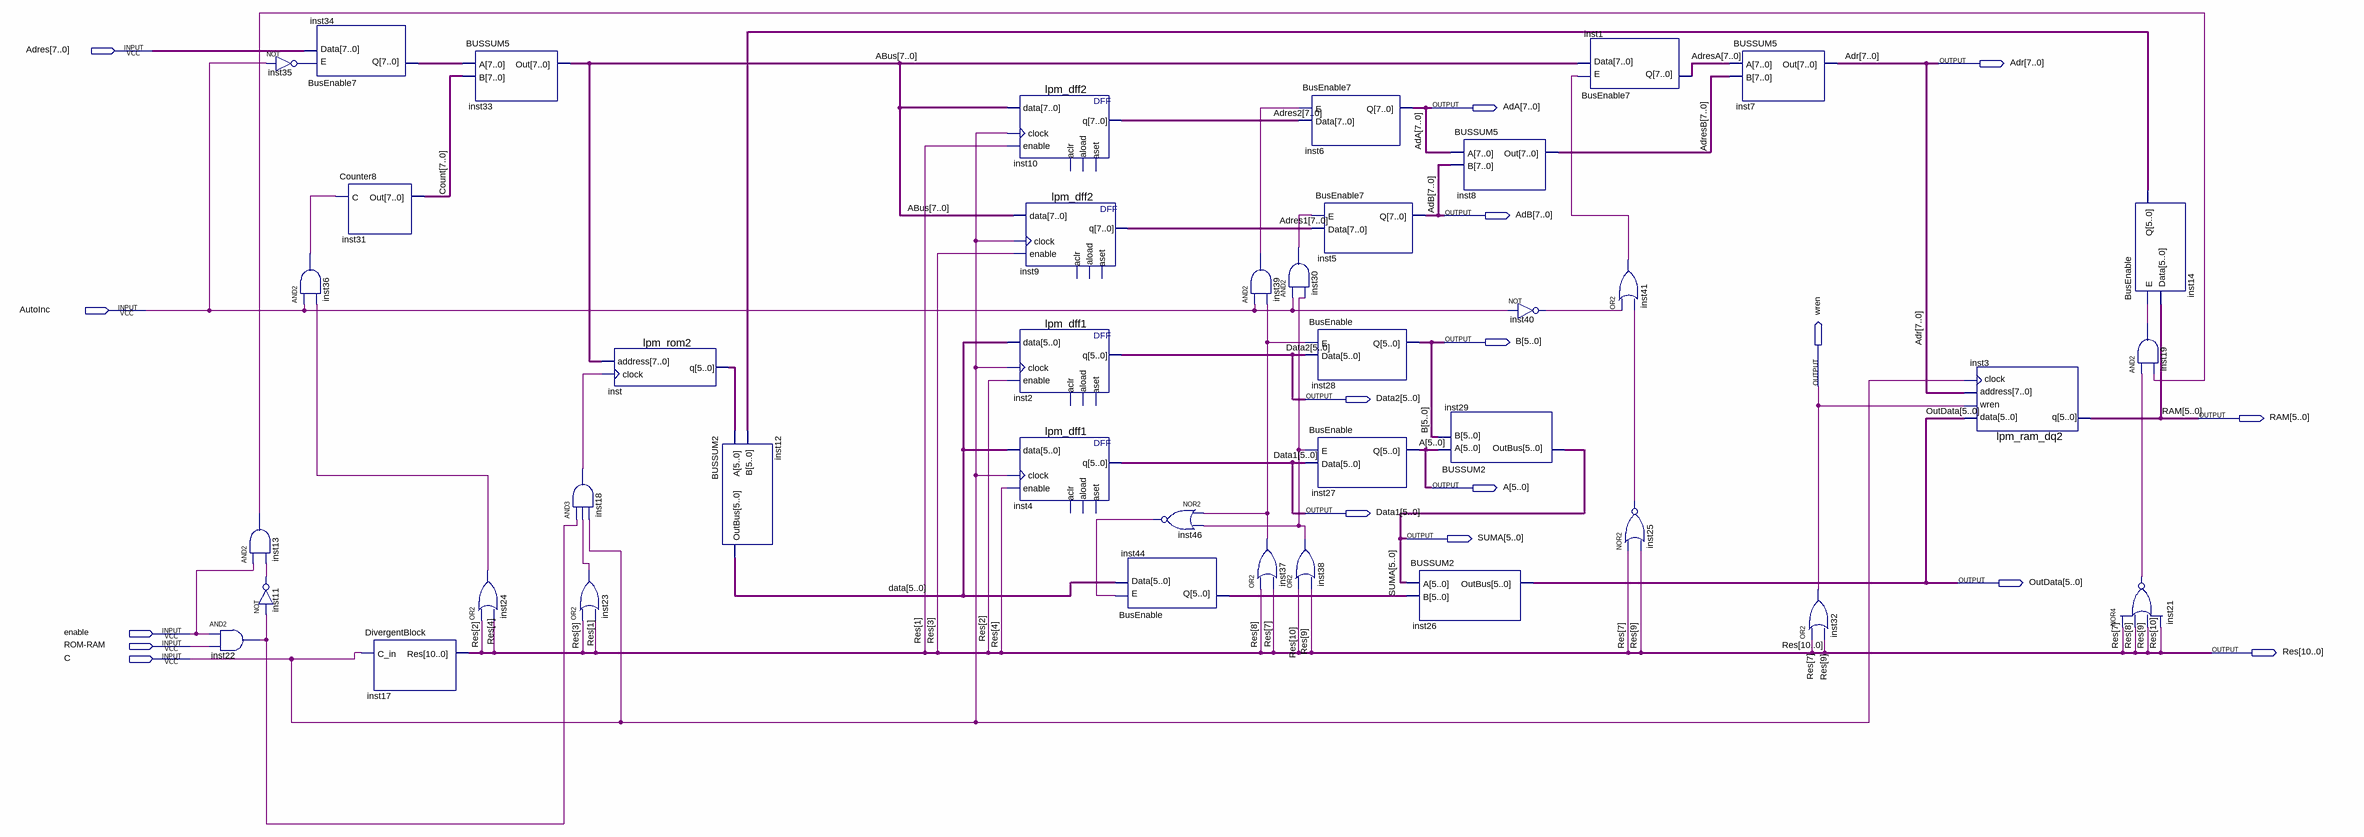
[diagram p0: schematic sheet]
// Quartus schematic L3.bdf as structural Verilog: 41 symbols, 17 pins
module L3 (
  input  [7:0] Adres,
  input  AutoInc,
  input  enable,
  input  \ROM-RAM ,
  input  C,
  output [7:0] Adr,
  output [7:0] AdA,
  output [7:0] AdB,
  output [5:0] B,
  output wren,
  output [5:0] Data2,
  output [5:0] RAM,
  output [5:0] A,
  output [5:0] Data1,
  output [5:0] SUMA,
  output [5:0] OutData,
  output [10:0] Res
);

  wire inst11_out, inst13_out, inst18_out, inst19_out, inst21_out, inst22_out, inst23_out, inst24_out,
       inst25_out, inst30_out, inst35_out, inst36_out, inst37_out, inst38_out, inst39_out, inst40_out,
       inst41_out, inst46_out;
  wire [5:0] data, inst14_q, inst44_q, inst_q;
  wire [7:0] ABus, Adres1, Adres2, AdresA, AdresB, Count, inst34_q;

  and inst22 (inst22_out, enable, \ROM-RAM );
  not inst35 (inst35_out, AutoInc);
  and inst13 (inst13_out, enable, inst11_out);
  not inst11 (inst11_out, inst22_out);
  BusEnable7 inst34 (.E(inst35_out), .Data(Adres), .Q(inst34_q));
  and inst36 (inst36_out, AutoInc, inst24_out);
  Counter8 inst31 (.C(inst36_out), .Out(Count));
  DivergentBlock inst17 (.C_in(C), .Res(Res));
  BUSSUM5 inst33 (.A(inst34_q), .B(Count), .Out(ABus));
  or inst24 (inst24_out, Res[2], Res[4]);
  and inst18 (inst18_out, inst22_out, inst23_out, C);
  or inst23 (inst23_out, Res[3], Res[1]);
  lpm_rom2 inst (.address(ABus), .clock(inst18_out), .q(inst_q));
  BUSSUM2 inst12 (.A(inst_q), .B(inst14_q), .OutBus(data));
  lpm_dff2 inst10 (.data(ABus), .clock(C), .enable(Res[1]), .q(Adres2));  // open: aclr, aload, aset
  lpm_dff2 inst9 (.data(ABus), .clock(C), .enable(Res[3]), .q(Adres1));  // open: aclr, aload, aset
  lpm_dff1 inst2 (.data(data), .clock(C), .enable(Res[2]), .q(Data2));  // open: aclr, aload, aset
  lpm_dff1 inst4 (.data(data), .clock(C), .enable(Res[4]), .q(Data1));  // open: aclr, aload, aset
  BusEnable inst44 (.E(inst46_out), .Data(data), .Q(inst44_q));
  nor inst46 (inst46_out, inst37_out, inst38_out);
  and inst30 (inst30_out, AutoInc, inst38_out);
  and inst39 (inst39_out, AutoInc, inst37_out);
  or inst37 (inst37_out, Res[8], Res[7]);
  BusEnable7 inst6 (.E(inst39_out), .Data(Adres2), .Q(AdA));
  BusEnable7 inst5 (.E(inst30_out), .Data(Adres1), .Q(AdB));
  BusEnable inst28 (.E(inst37_out), .Data(Data2), .Q(B));
  BusEnable inst27 (.E(inst38_out), .Data(Data1), .Q(A));
  or inst38 (inst38_out, Res[10], Res[9]);
  BUSSUM2 inst26 (.A(SUMA), .B(inst44_q), .OutBus(OutData));
  BUSSUM5 inst8 (.A(AdA), .B(AdB), .Out(AdresB));
  BUSSUM2 inst29 (.A(A), .B(B), .OutBus(SUMA));
  not inst40 (inst40_out, AutoInc);
  BusEnable7 inst1 (.E(inst41_out), .Data(ABus), .Q(AdresA));
  or inst41 (inst41_out, inst40_out, inst25_out);
  nor inst25 (inst25_out, Res[7], Res[9]);
  BUSSUM5 inst7 (.A(AdresA), .B(AdresB), .Out(Adr));
  or inst32 (wren, Res[7], Res[9]);
  lpm_ram_dq2 inst3 (.data(OutData), .wren(wren), .address(Adr), .clock(C), .q(RAM));
  BusEnable inst14 (.E(inst19_out), .Data(RAM), .Q(inst14_q));
  and inst19 (inst19_out, inst21_out, inst13_out);
  nor inst21 (inst21_out, Res[7], Res[8], Res[9], Res[10]);
endmodule
